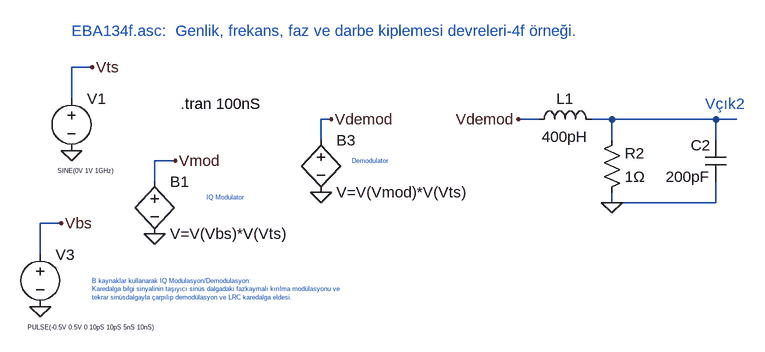
[diagram p0: schematic EBA134f.asc]
EBA134f.asc, the LTspice schematic file:
Version 4
SHEET 1 1288 1940
WIRE -1776 -128 -1808 -128
WIRE -1808 -80 -1808 -128
WIRE -1408 -48 -1424 -48
WIRE -1088 -48 -1120 -48
WIRE -976 -48 -1008 -48
WIRE -816 -48 -976 -48
WIRE -784 -48 -816 -48
WIRE -1424 -16 -1424 -48
WIRE -976 -16 -976 -48
WIRE -816 -16 -816 -48
WIRE -1648 16 -1680 16
WIRE -1680 48 -1680 16
WIRE -976 80 -976 64
WIRE -816 80 -816 48
WIRE -816 80 -976 80
WIRE -1824 112 -1856 112
WIRE -1856 160 -1856 112
FLAG -1808 0 0
FLAG -1680 128 0
FLAG -1856 240 0
FLAG -1776 -128 Vts
FLAG -1648 16 Vmod
FLAG -1424 64 0
FLAG -1408 -48 Vdemod
FLAG -976 80 0
FLAG -1824 112 Vbs
FLAG -1120 -48 Vdemod
SYMBOL voltage -1808 -96 R0
WINDOW 3 -21 127 Left 0
WINDOW 123 0 0 Left 0
WINDOW 39 0 0 Left 0
SYMATTR Value SINE(0V 1V 1GHz)
SYMATTR InstName V1
SYMBOL bv -1680 32 R0
SYMATTR InstName B1
SYMATTR Value V=V(Vbs)*V(Vts)
SYMBOL voltage -1856 144 R0
WINDOW 3 -19 128 Left 0
WINDOW 123 0 0 Left 0
WINDOW 39 0 0 Left 0
SYMATTR Value PULSE(-0.5V 0.5V 0 10pS 10pS 5nS 10nS)
SYMATTR InstName V3
SYMBOL bv -1424 -32 R0
SYMATTR InstName B3
SYMATTR Value V=V(Vmod)*V(Vts)
SYMBOL res -992 80 M180
WINDOW 0 36 76 Left 2
WINDOW 3 36 40 Left 2
SYMATTR InstName R2
SYMATTR Value 1Ω
SYMBOL cap -800 48 R180
WINDOW 0 24 56 Left 2
WINDOW 3 24 8 Left 2
SYMATTR InstName C2
SYMATTR Value 200pF
SYMBOL ind -1104 -32 R270
WINDOW 0 32 56 VTop 2
WINDOW 3 5 56 VBottom 2
SYMATTR InstName L1
SYMATTR Value 400pH
TEXT -1640 -72 Left 2 !.tran 100nS
TEXT -1600 72 Left 0 ;IQ Modulator
TEXT -1376 16 Left 0 ;Demodulator
TEXT -1776 200 Left 0 ;B kaynaklar kullanarak IQ Modulasyon/Demodulasyon:\nKaredalga bilgi sinyalinin taşıyıcı sinüs dalgadaki fazkaymalı kırılma modülasyonu ve\ntekrar sinüsdalgayla çarpılıp demodülasyon ve LRC karedalga eldesi.
TEXT -832 -72 Left 2 ;Vçık2
TEXT -1808 -184 Left 2 ;EBA134f.asc:  Genlik, frekans, faz ve darbe kiplemesi devreleri-4f örneği.

The netlist it stands for:
* EBA134f.asc
V1 Vts 0 SINE(0V 1V 1GHz)
B1 Vmod 0 V=V(Vbs)*V(Vts)
V3 Vbs 0 PULSE(-0.5V 0.5V 0 10pS 10pS 5nS 10nS)
B3 Vdemod 0 V=V(Vmod)*V(Vts)
R2 0 N001 1Ω
C2 0 N001 200pF
L1 Vdemod N001 400pH
.tran 100nS
* IQ Modulator
* Demodulator
* B kaynaklar kullanarak IQ Modulasyon/Demodulasyon:
* Karedalga bilgi sinyalinin taşıyıcı sinüs dalgadaki fazkaymalı kırılma modülasyonu ve
* tekrar sinüsdalgayla çarpılıp demodülasyon ve LRC karedalga eldesi.
* Vçık2
* EBA134f.asc:  Genlik, frekans, faz ve darbe kiplemesi devreleri-4f örneği.
.backanno
.end